# EAGLE design Qwiic_1Wire_to_I2C_Bridge_DS28E17_MILLABLE (EAGLE 7.6.0)
ABBREV: hb1; PROJECT: Heading Board
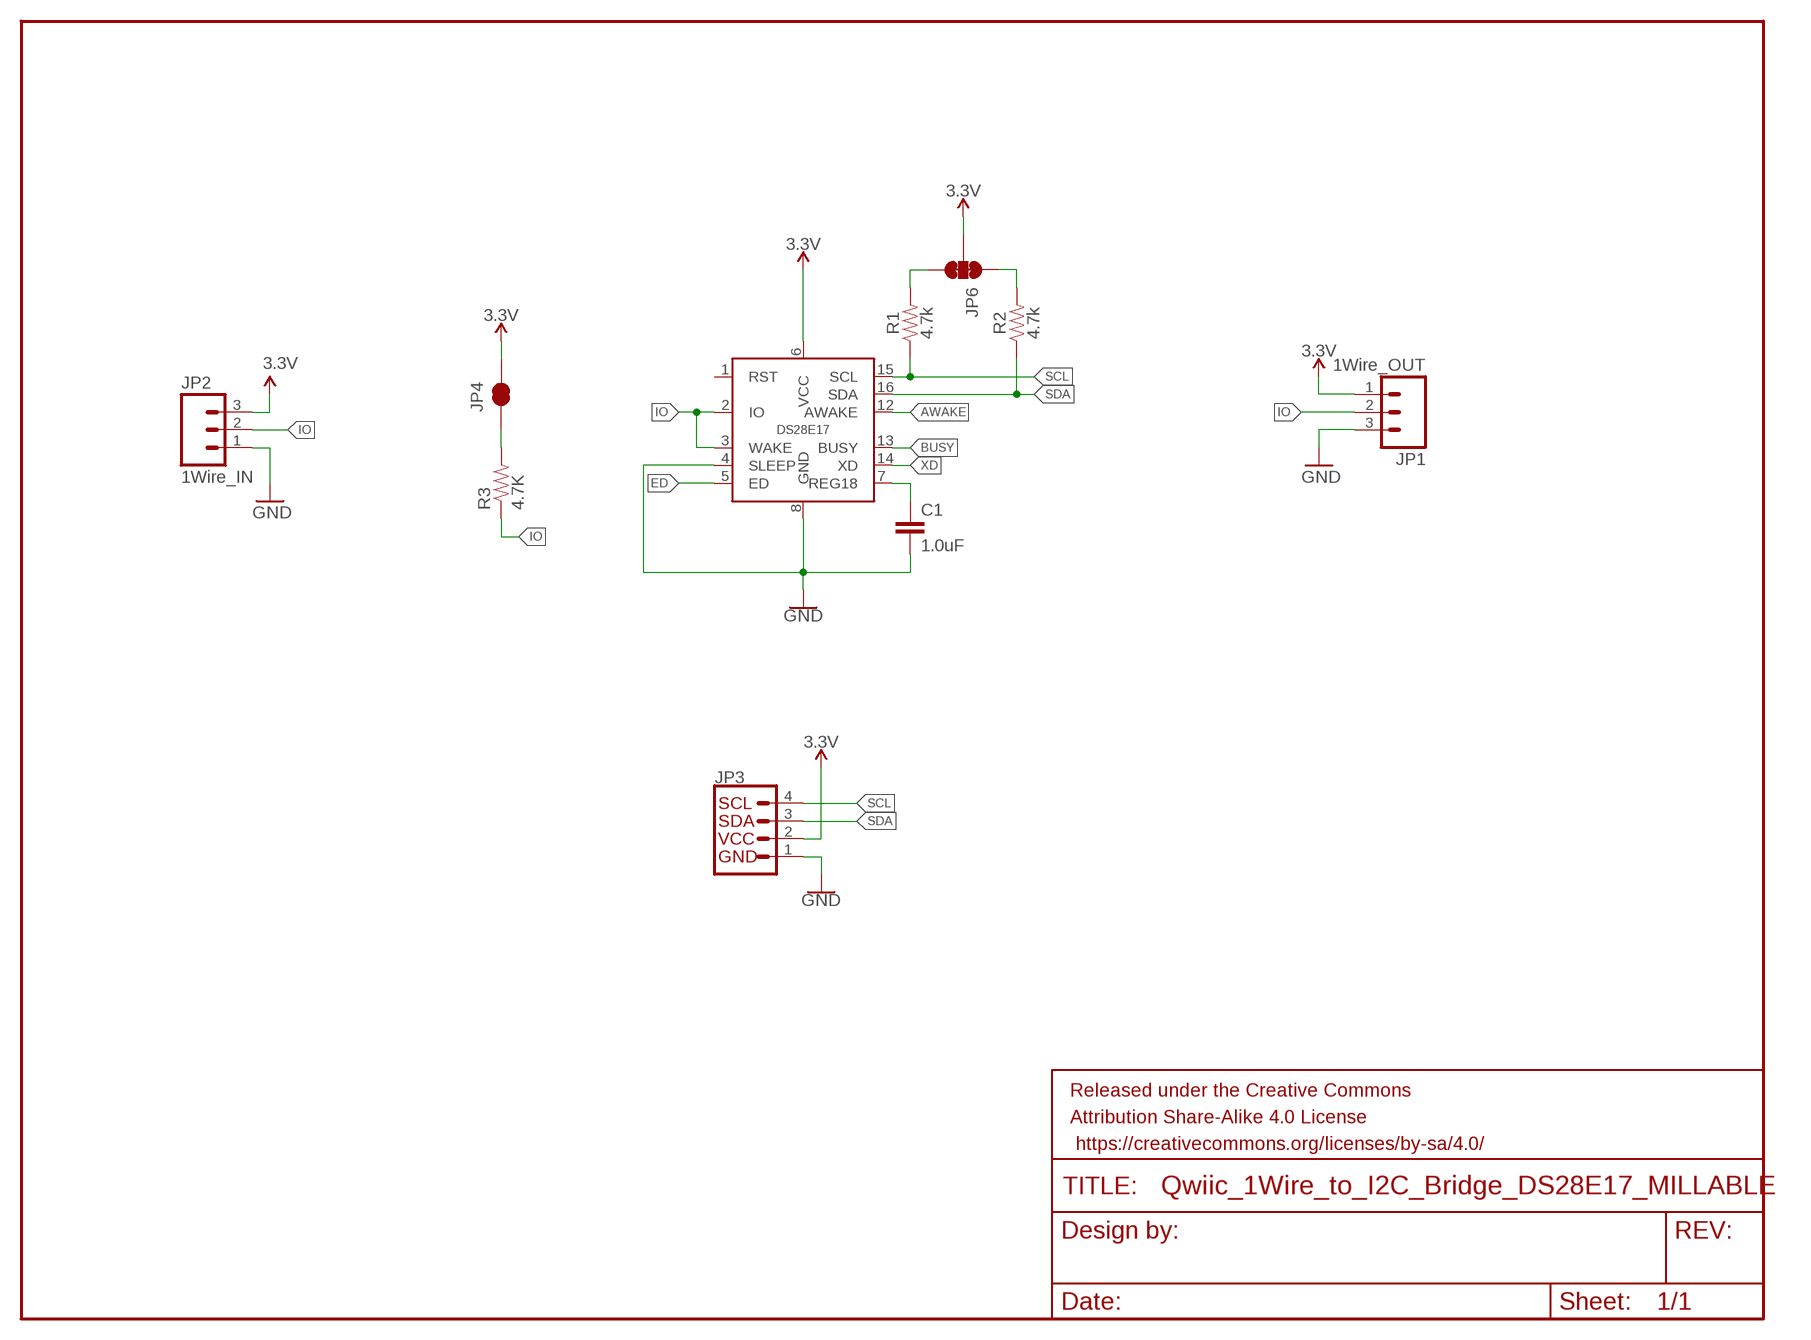
[diagram p0: schematic, sheet 1]

## Parts
C1  1.0uF  1.0UF-0603-16V-10%  [0603]
FRAME1  FRAME-LETTER  [CREATIVE_COMMONS]
JP1  1Wire_OUT  M03PTH  [1X03]
JP2  1Wire_IN  M03PTH  [1X03]
JP3  I2C_STANDARDJS-1MM  [1X04_1MM_RA]
JP4  JUMPER-SMT_2_NC_TRACE_NO-SILK  [SMT-JUMPER_2_NC_TRACE_NO-SILK]
JP6  JUMPER-SMT_3_2-NC_TRACE_NO-SILK  [SMT-JUMPER_3_2-NC_TRACE_NO-SILK]
R1  4.7k  4.7KOHM-0603-1/10W-1%  [0603]
R2  4.7k  4.7KOHM-0603-1/10W-1%  [0603]
R3  4.7K  4.7KOHM-1/10W-1%(0603)  [0603-RES]
U$2  DS28E17  [TQFN-16_4X4]

## Nets
3.3V: JP1.1 JP2.3 JP3.2(VCC) JP4.2 JP6.2 U$2.6(VCC)
AWAKE: U$2.12(AWAKE)
BUSY: U$2.13(BUSY)
ED: U$2.5(ED)
GND: C1.2 JP1.3 JP2.1 JP3.1(GND) U$2.4(SLEEP) U$2.8(GND)
IO: JP1.2 JP2.2 R3.1 U$2.2(IO) U$2.3(WAKE)
N$1: C1.1 U$2.7(REG18)
N$2: JP4.1 R3.2
N$3: JP6.1 R2.2
N$4: JP6.3 R1.2
SCL: JP3.4(SCL) R1.1 U$2.15(SCL)
SDA: JP3.3(SDA) R2.1 U$2.16(SDA)
XD: U$2.14(XD)
Unconnected: U$2.1(RST)

## Library data of the parts
C1 = SparkFun-Capacitors:1.0UF: 1µF ceramic capacitors A capacitor is a passive two-terminal electrical component used to store electrical energy temporarily in an electric field.; PROD_ID: CAP-00868
FRAME1 = SparkFun-Aesthetics:FRAME-LETTER: Schematic Frame - Letter Standard 8.5x11 US Letter frame
JP1 JP2 = SparkFun-Connectors:M03: Header 3 Standard 3-pin 0.1" header. Use with straight break away headers (SKU : PRT-00116), right angle break away headers (PRT-00553), swiss pins (PRT-00743), machine pins (PRT-00117), and female headers (PRT-00115). Molex polarized connector foot print use with SKU : PRT-08232 with associated crimp pins and housings.
JP3 = SparkX:I2C_STANDARD: SparkFun I2C Standard Pinout Header SparkFun has standardized on a pinout for all I2C based sensor breakouts. This pinout allows I2C boards to be plugged directly into the headers on Arduino Uno compatible boards, and to be daisy chained easily. Example SparkFun Products: SparkFun Atmospheric Sensor Breakout - BME280 <https://www.sparkfun.com/products/13676> SparkFun Altitude/Pressure Sensor Breakout - MPL3115A2 <https://www.sparkfun.com/products/11084> SparkFun TOF Range Finder Sensor - VL6180 <https://www.sparkfun.com/products/12785>
JP4 = SparkFun-Jumpers:JUMPER-SMT_2_NC_TRACE: Normally closed trace jumper This jumper has a trace between two pads so it's normally closed (NC). Use a razor knife to open the connection. For best results follow the IPC guidelines for cutting traces: Cutout at least 0.063 mm (0.005 in). Remove all loose material to clean up the cut area. Seal the cut with an approved epoxy. Reapply solder to reclose the connection.
JP6 = SparkFun-Jumpers:JUMPER-SMT_3_2-NC_TRACE: Normally closed trace jumper (2 of 2 connections) This jumper has a trace between all three pads so they are normally closed (NC). Use a razor knife to open the connection(s). For best results follow the IPC guidelines for cutting traces: Cutout at least 0.063 mm (0.005 in). Remove all loose material to clean up the cut area. Seal the cut with an approved epoxy. Reapply solder to reclose the connection(s).
R1 R2 = SparkFun-Resistors:4.7KOHM: 4.7kΩ resistor A resistor is a passive two-terminal electrical component that implements electrical resistance as a circuit element. Resistors act to reduce current flow, and, at the same time, act to lower voltage levels within circuits. - Wikipedia; PROD_ID: RES-07857
R3 = SparkFun-Resistors:4.7KOHM-1/10W-1%(0603): RES-07857; PROD_ID: RES-07857
U$2 = TaaraLabs:DS28E17: 1-Wire®-to-I2C Master Bridge Datasheet: https://datasheets.maximintegrated.com/en/ds/DS28E17.pdf

## Net classes
0 default: width 0.203 mm
1 power: width 0.381 mm, clearance 0.254 mm

## Board
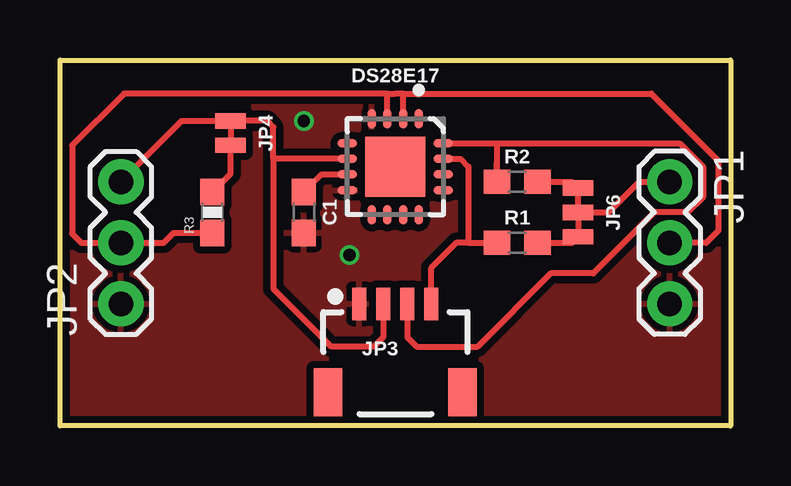
[diagram p1: board, top side]
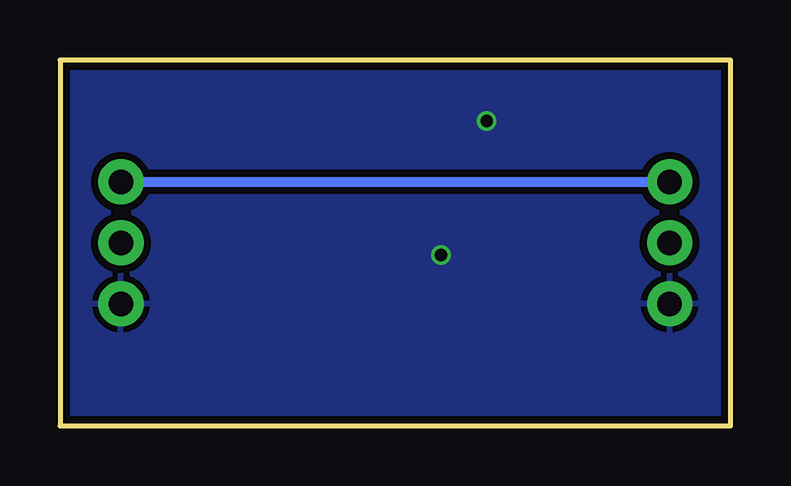
[diagram p2: board, bottom side, seen from below]

Size 27.94 x 15.24 mm. Coordinates in mm from the lower left corner, seen from the top.
Outline: 0,0 0,15.24 27.94,15.24 27.94,0 0,0
Copper layers (1*16): Top 0.035mm / dielectric 1.5mm / Bottom 0.035mm
Design rules "ITEADstudio_DRC": minimum track width 6mil, minimum drill 12mil, track to track 6mil, track to pad 6mil, pad to pad 6mil, via to via 6mil, smd to smd 0mil, copper to edge 10mil, drill to drill 10mil, minimum pad ring 10mil, minimum via ring 6mil, stop-mask expansion 2mil, vias tented up to drill 100mil, thermal gap 10mil

### Footprints (pad centres in the part's own frame; a part is rotated, then mirrored left to right if it is on the bottom)
0603 = smd 1.1 x 1: 1 -0.85,0; 2 0.85,0
1X03 = drill 1.016 pad 1.88: 1 0,0; 2 2.54,0; 3 5.08,0
1X04_1MM_RA = smd 0.6 x 1.35: 1 -1.5,0; 2 -0.5,0; 3 0.5,0; 4 1.5,0 | smd 1.2 x 2: NC1 2.8,-3.675; NC2 -2.8,-3.675
SMT-JUMPER_2_NC_TRACE_NO-SILK = smd 0.635 x 1.27: 1 -0.508,0; 2 0.508,0
SMT-JUMPER_3_2-NC_TRACE_NO-SILK = smd 0.635 x 1.27: 1 -1.016,0; 2 0,0; 3 1.016,0
0603-RES = smd 1.1 x 1: 1 -0.85,0; 2 0.85,0
TQFN-16_4X4 = smd 0.8 x 0.35: 1 -2,0.975; 2 -2,0.325; 3 -2,-0.325; 4 -2,-0.975; 9 2,-0.975; 10 2,-0.325; 11 2,0.325; 12 2,0.975 | smd 0.35 x 0.8: 5 -0.975,-2; 6 -0.325,-2; 7 0.325,-2; 8 0.975,-2; 13 0.975,2; 14 0.325,2; 15 -0.325,2; 16 -0.975,2 | smd 2.5 x 2.5: PAD 0,0

### Placement (x,y rotation side)
C1  10.16,8.89 270 top
FRAME1  21.59,-12.7 0 top  (outside the outline)
JP1  25.4,10.16 270 top
JP2  2.54,5.08 90 top
JP3  13.97,5.08 0 top
JP4  7.11,12.19 270 top
JP6  21.59,8.89 270 top
R1  19.05,7.62 0 top
R2  19.05,10.16 0 top
R3  6.35,8.89 90 top
U$2  13.97,10.79 270 top

### Tracks (layer width: path | path; a pad name or v marks a point on that pad's centre or on a via)
3.3V
  Top 0.254: U$2.6 8.89,11.12 | JP2.3 5.08,12.7 7.11,12.7 8.64,12.7 8.89,12.45 8.89,11.12 | JP3.2 13.46,3.68 13.08,3.3 11.3,3.3 8.89,5.71 8.89,11.12 | JP6.2 22.86,8.89 24.13,10.16 JP1.1
  Bottom 0.406: JP1.1 JP2.3
GND  (via drill 0.51)
  other vias: 12.06,7.11 10.16,12.7
  pour Top (isolate 0.305): 0,15.24 0,0 27.94,0 27.94,15.24
  pour Bottom (isolate 0.305): 0,15.24 0,0 27.94,0 27.94,15.24
IO
  Top 0.254: R3.1 4.74,8.04 4.32,7.62 JP2.2 0.89,7.62 0.51,8 0.51,11.68 2.67,13.84 13.64,13.84 | U$2.3 13.64,13.84 | 14.29,13.84 U$2.2 14.29,13.64 | 14.29,13.84 24.64,13.84 27.43,11.05 27.43,8.13 26.92,7.62 JP1.2 | 14.29,13.84 14.1,13.84 13.97,13.84 13.64,13.84
N$1
  Top 0.254: C1.1 10.89,10.47 U$2.7
N$2
  Top 0.254: R3.2 7.11,10.5 7.11,11.68
N$3
  Top 0.254: R2.2 21.34,10.16 JP6.1
N$4
  Top 0.254: R1.2 21.34,7.62 JP6.3
SCL
  Top 0.254: U$2.15 16.69,11.12 17.02,10.79 17.02,7.62 | 17.27,7.62 R1.1 17.02,7.62 | JP3.4 15.47,6.58 16.51,7.62 17.02,7.62
SDA
  Top 0.254: 18.2,11.77 R2.1 18.2,10.96 | JP3.3 14.48,3.68 14.86,3.3 17.4,3.3 20.45,6.35 22.23,6.35 24.77,8.89 26.16,8.89 26.8,9.53 26.8,10.79 25.82,11.77 18.2,11.77 | U$2.16 18.2,11.77